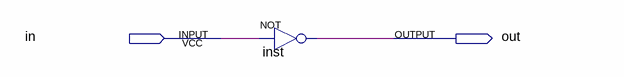
[diagram p0: schematic sheet]
// Quartus schematic test1.bdf as structural Verilog: 1 symbols, 2 pins
module test1 (
  input  in,
  output out
);

  not inst (out, in);
endmodule
